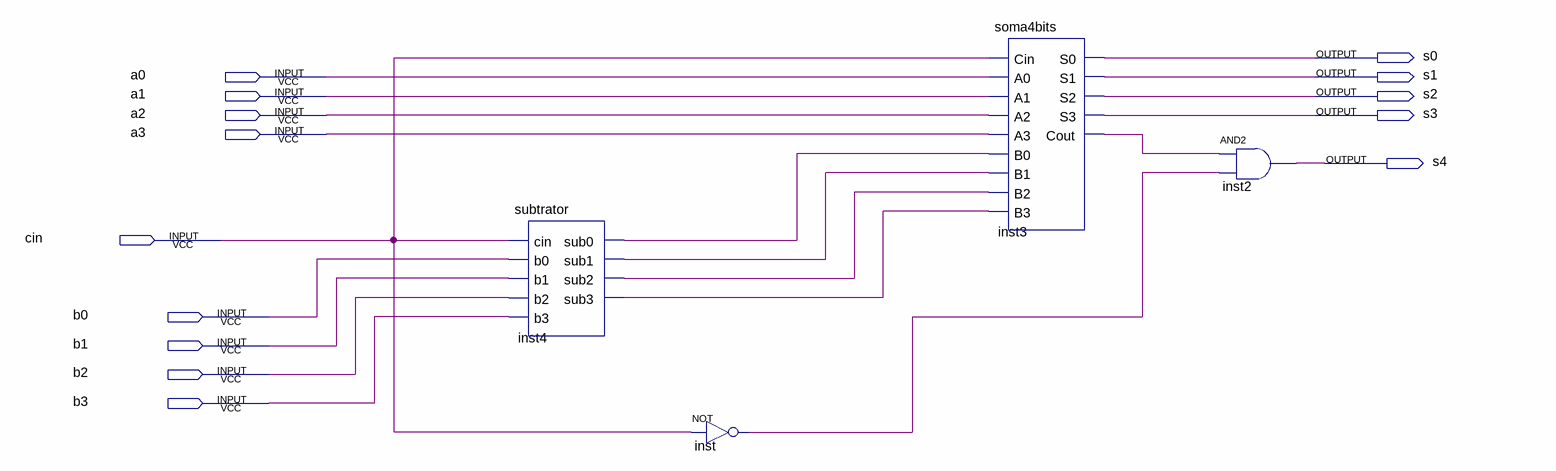
[diagram p0: schematic sheet]
// Quartus schematic somaesub.bdf as structural Verilog: 4 symbols, 14 pins
module somaesub (
  input  a0,
  input  a1,
  input  a2,
  input  a3,
  input  cin,
  input  b0,
  input  b1,
  input  b2,
  input  b3,
  output s0,
  output s1,
  output s2,
  output s3,
  output s4
);

  wire inst3_cout, inst4_sub0, inst4_sub1, inst4_sub2, inst4_sub3, inst_out;

  subtrator inst4 (
    .cin(cin), .b0(b0), .b1(b1), .b2(b2), .b3(b3), .sub0(inst4_sub0), .sub1(inst4_sub1), .sub2(inst4_sub2),
    .sub3(inst4_sub3));
  not inst (inst_out, cin);
  soma4bits inst3 (
    .Cin(cin), .A0(a0), .A1(a1), .A2(a2), .A3(a3), .B0(inst4_sub0), .B1(inst4_sub1), .B2(inst4_sub2),
    .B3(inst4_sub3), .S0(s0), .S1(s1), .S2(s2), .S3(s3), .Cout(inst3_cout));
  and inst2 (s4, inst3_cout, inst_out);
endmodule
